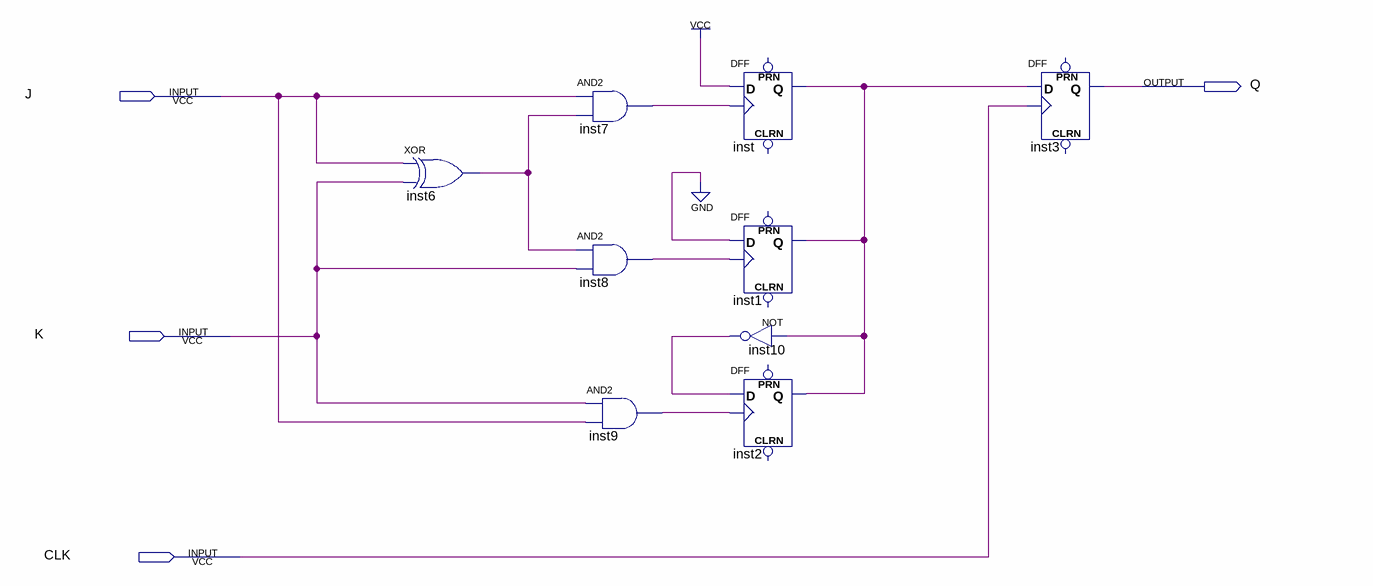
[diagram p0: schematic sheet]
// Quartus schematic FFJKconFFD.bdf as structural Verilog: 9 symbols, 4 pins
module FFJKconFFD (
  input  J,
  input  K,
  input  CLK,
  output Q
);

  wire inst6_out, inst7_out, inst8_out, inst9_out, inst10_out, inst_q;

  xor inst6 (inst6_out, J, K);
  and inst7 (inst7_out, J, inst6_out);
  and inst8 (inst8_out, inst6_out, K);
  and inst9 (inst9_out, K, J);
  DFF inst (.CLK(inst7_out), .D(1'b1), .Q(inst_q));  // open: CLRN, PRN
  DFF inst1 (.CLK(inst8_out), .D(1'b0), .Q(inst_q));  // open: CLRN, PRN
  not inst10 (inst10_out, inst_q);
  DFF inst2 (.CLK(inst9_out), .D(inst10_out), .Q(inst_q));  // open: CLRN, PRN
  DFF inst3 (.CLK(CLK), .D(inst_q), .Q(Q));  // open: CLRN, PRN
endmodule
